# EAGLE schematic cpu-driver (EAGLE 6.4)
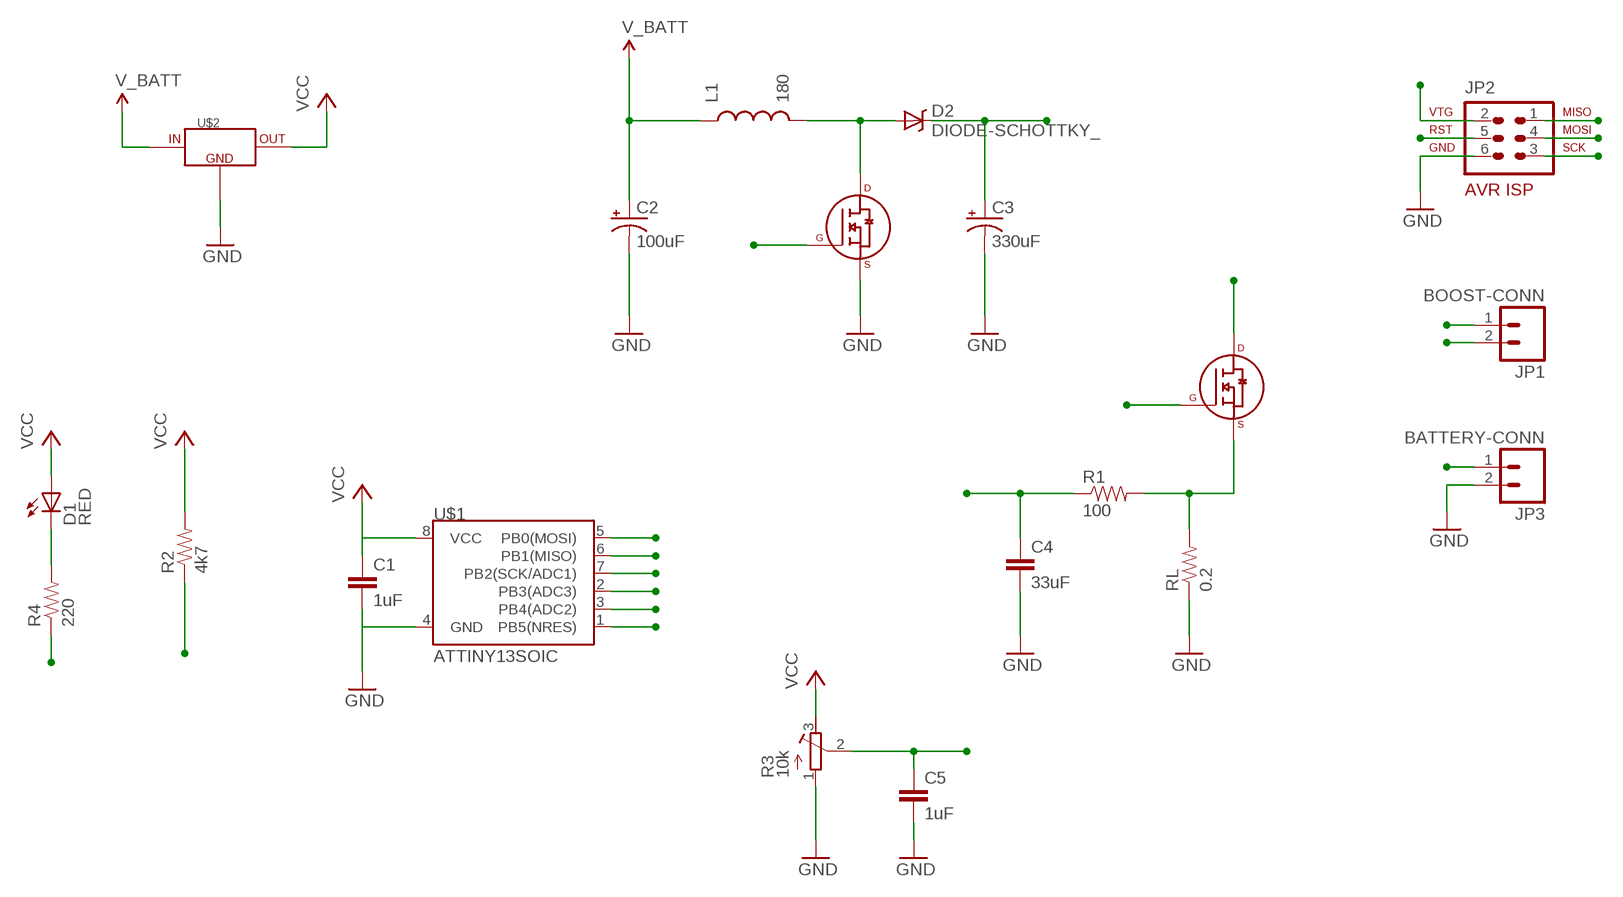
[diagram p0: schematic, sheet 1]

## Parts
C1  1uF  CAP0603-CAP  [0603-CAP]
C2  100uF  CPOL-USD  [PANASONIC_D]
C3  330uF  CPOL-USD  [PANASONIC_D]
C4  33uF  CAP0603-CAP  [0603-CAP]
C5  1uF  CAP0603-CAP  [0603-CAP]
D1  RED  LED-RED0603  [LED-0603]
D2  DIODE-SCHOTTKY_  [SMA-DIODE]
JP1  BOOST-CONN  M02LOCK_LONGPADS  [1X02_LOCK_LONGPADS]
JP2  AVR-ISP-6  [AVR-ISP-6]
JP3  BATTERY-CONN  M02LOCK_LONGPADS  [1X02_LOCK_LONGPADS]
L1  180  INDUCTORDR1030  [DR1030]
Q1  RFD14N05L  [TO-252AA]
Q2  RFD14N05L  [TO-252AA]
R1  100  RESISTOR0603-RES  [0603-RES]
R2  4k7  RESISTOR0603-RES  [0603-RES]
R3  10k  R-TRIMM64Y  [RTRIM64Y]
R4  220  RESISTOR0603-RES  [0603-RES]
RL  0.2  RESISTOR2512  [R2512]
U$1  ATTINY13SOIC  [SO08]
U$2  TPS715XX  [SOT-23-5]

## Nets
BOOST+: C3.+ D2.C JP1.1
BOOST-: JP1.2 Q2.4(D)
GND: C1.2 C2.- C3.- C4.2 C5.2 JP2.6 JP3.2 Q1.3(S) R3.1(E) RL.1 U$1.4(GND) U$2.2(GND)
MISO: JP2.1 Q1.1(G) U$1.6(PB1(MISO))
MOSI: JP2.4 R4.1 U$1.5(PB0(MOSI))
N$1: D1.C R4.2
N$2: D2.A L1.2 Q1.4(D)
N$3: JP2.2
N$1334: Q2.3(S) R1.2 RL.2
PB3: C5.1 R3.2(S) U$1.2(PB3(ADC3))
PB4: C4.1 R1.1 U$1.3(PB4(ADC2))
RES: JP2.5 R2.1 U$1.1(PB5(NRES))
SCK: JP2.3 Q2.1(G) U$1.7(PB2(SCK/ADC1))
VBATT: C2.+ JP3.1 L1.1 U$2.4(IN) ; supply symbol labelled V_BATT
VCC: C1.1 D1.A R2.2 R3.3(A) U$1.8(VCC) U$2.5(OUT)

## Library data of the parts
C1 C4 C5 = SparkFun-Passives:CAP: Capacitor Standard 0603 ceramic capacitor, and 0.1" leaded capacitor.
C2 C3 = resistor:CPOL-US: POLARIZED CAPACITOR, American symbol
D1 = SparkFun-LED:LED-RED: Assorted Red LEDs LilyPad 1206- DIO-09912 1206- DIO-00809 0603- DIO-00819; PROD_ID: DIO-00819
D2 = SparkFun-DiscreteSemi:DIODE-SCHOTTKY: Commonly MBRA140.
JP1 JP3 = SparkFun-Connectors:M02: Standard 2-pin 0.1" header. Use with - straight break away headers ( PRT-00116) - right angle break away headers (PRT-00553) - swiss pins (PRT-00743) - machine pins (PRT-00117) - female headers (PRT-00115) Molex polarized connector foot print use with: PRT-08233 with associated crimp pins and housings. 2.54_SCREWTERM for use with PRT-10571. 3.5mm Screw Terminal footprints for PRT-08084 5mm Screw Terminal footprints for use with PRT-08433
JP2 = avr-4:AVR-ISP-6: AVR ISP-6 Serial Programming Header
L1 = SparkFun-Passives:INDUCTOR: Inductors Basic Inductor/Choke - 0603 and 1206. Footprints are not proven and vary greatly between part numbers.
Q1 Q2 = Synapseware:RFD14N05L: 14A, 50V, 0.100 Ohm, Logic Level, N-Channel Power MOSFETs
R1 R2 R4 RL = SparkFun-Passives:RESISTOR: Resistor Basic schematic elements and footprints for 0603, 1206, and PTH resistors.
R3 = resistor:R-TRIMM: Trimm resistor
U$1 = SparkFun-DigitalIC:ATTINY13: Atmel 8-pin 1kB flash uC
U$2 = Synapseware:TPS715XX: 50 mA, 24 V, 3.2-mA Supply Current Low-Dropout Linear Regulator in SC70 (SOT-323) Package TPS71550DCKR - 5.0V version TPS71533DCKR - 3.3V version TPS71525DCKR - 2.5V version